# Altium schematic sheet Sheet1.SchDoc
size 420 x 297 mm; Date: 30.09.2018; CompanyName: Techshift; Organization: Techshift; Address1: Address1; Address2: Address2; Address3: Address3; Address4: Address4; DocumentNumber: HALL.STD.v2; SheetNumber: 1; Scale: 1:1; DocumentType: Схема электрическая принципиальная; FirstReferrence: АБВГ.123456.001; DocumentName: HALL.STD.v2
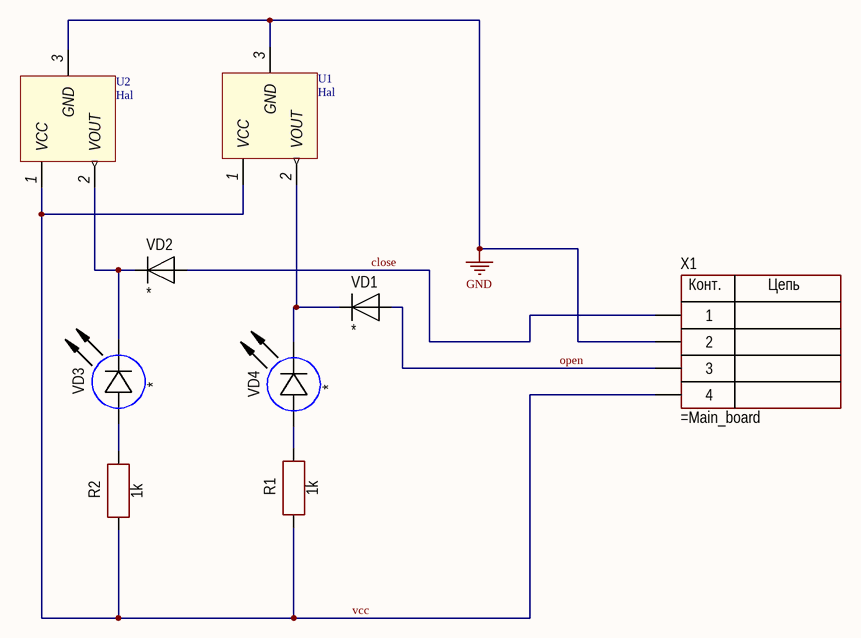
[diagram p0: Sheet1.SchDoc]

## Parts
R1  1k  [CH0805R]
R2  1k  [CH0805R]
U1  Hal  [A1103ELHLT-T]
U2  Hal  [A1103ELHLT-T]
VD1  *  [SOD123]
VD2  *  [SOD123]
VD3  *  [CH0805LB]
VD4  *  [CH0805LR]
X1  (no value)  [CON: PLS-4(90)]

## Nets
GND: U1.3(GND) U2.3(GND) X1.2
close: VD2.1 X1.1
open: VD1.1 X1.3
vcc: R1.1 R2.1 U1.1(VCC) U2.1(VCC) X1.4
NetR1_2: R1.2 VD4.1(A)
NetR2_2: R2.2 VD3.1(A)
NetU1_2: U1.2(VOUT) VD1.2 VD4.2(C)
NetU2_2: U2.2(VOUT) VD2.2 VD3.2(C)

## Notes on the sheet
- Перв. примен.
- Справ. №
- Подп. и дата
- Инв. № дубл.
- Взам. инв. №
- Разраб.
- Изм.
- Лист
- № докум.
- Подп.
- Дата
- Лит.
- Масса
- Масштаб
- Пров.
- Т.контр.
- Листов
- Инв. № подл.
- Утв.
- Н.контр.
- 2.106-A3
- Копировал
- Формат А3
- (in symbol 4-Connector) Конт.; Цепь

## Library data of the parts
R1 R2 = Resistor: Manufacturer: *; Model: *; HelpURL: *; ComponentKind: *; Value: 1k
VD1 VD2 = Diod: ComponentKind: *; Manufacturer: *; Model: *; HelpURL: *
VD3 VD4 = LED: Manufacturer: *; Model: *; HelpURL: *; ComponentKind: *; Value: *
X1 = 4-Connector: Model: *; Manufacturer: *; HelpURL: *; ComponentKind: *
U1 U2 = Hal: Model: *; Package: *; Datasheet: *; Manufacture: *; HelpURL: *; Case: *